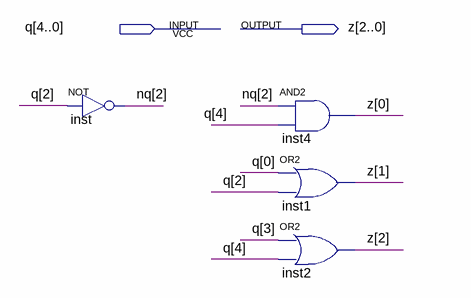
[diagram p0: schematic sheet]
// Quartus schematic johnson_decoder.bdf as structural Verilog: 4 symbols, 2 pins
module johnson_decoder (
  input  [4:0] q,
  output [2:0] z
);

  wire [2:2] nq;

  not inst (nq[2], q[2]);
  and inst4 (z[0], nq[2], q[4]);
  or inst1 (z[1], q[0], q[2]);
  or inst2 (z[2], q[3], q[4]);
endmodule
